# EAGLE design microsd (EAGLE 6.5.0)
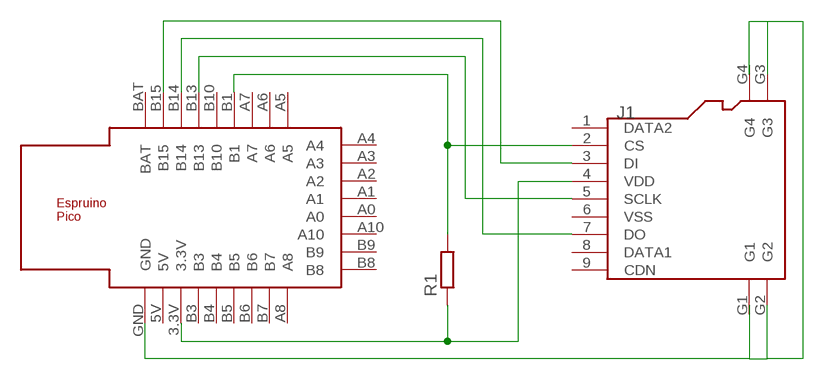
[diagram p0: schematic, sheet 1]

## Parts
J1  MICRO-SDCARD-CONNECTOR-3300060P1  [9P-SMD-W/-RING]
R1  R-EU_R1206  [R1206]
U$1  ESPRUINO_PICO_SMDONLY  [ESPRUINO_PICO_SMDONLY]

## Nets
N$2: U$1.GND
N$3: J1.4(VDD) R1.1 U$1.3.3V
N$4: J1.3(DI) U$1.B15
N$5: J1.7(DO) U$1.B14
N$6: J1.5(SCLK) U$1.B13
N$7: J1.2(CS) R1.2 U$1.B1
Unconnected: J1.1(DATA2) J1.6(VSS) J1.8(DATA1) J1.9(CDN) J1.G1 J1.G2 J1.G3 J1.G4 U$1.5V U$1.A0 U$1.A1 U$1.A2 U$1.A3 U$1.A4 U$1.A5 U$1.A6 U$1.A7 U$1.A8 U$1.A10 U$1.B3 U$1.B4 U$1.B5 U$1.B6 U$1.B7 U$1.B8 U$1.B9 U$1.B10 U$1.BAT

## Library data of the parts
J1 = OPL Eagle Library:MICRO-SDCARD-CONNECTOR
R1 = rcl:R-EU_: RESISTOR, European symbol
U$1 = espruino_pico:ESPRUINO_PICO_SMDONLY

## Net classes
0 default: width 0.305 mm

## Board
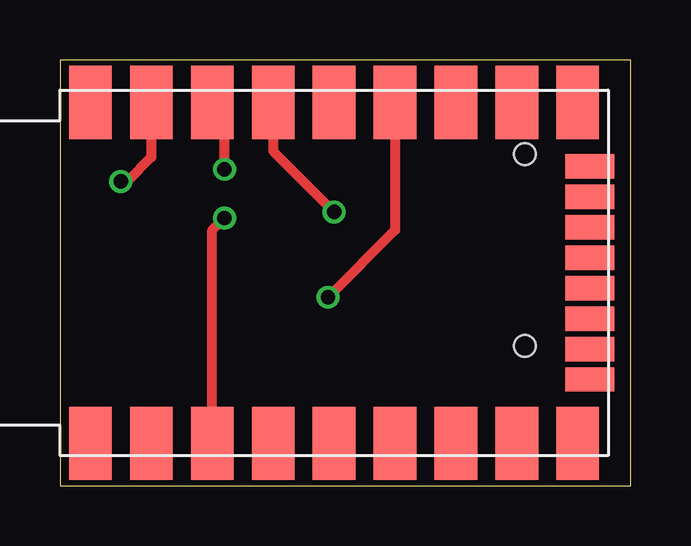
[diagram p1: board, top side]
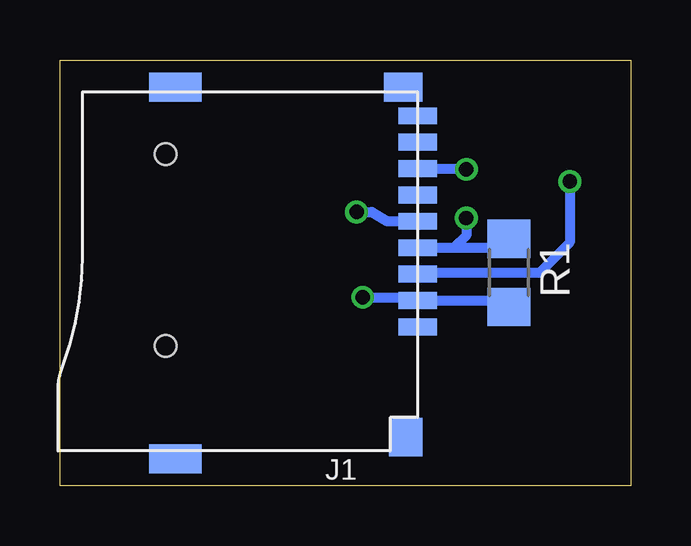
[diagram p2: board, bottom side, seen from below]

Size 23.8 x 17.77 mm. Coordinates in mm from the lower left corner, seen from the top.
Outline: 0,0 23.8,0 23.8,17.77 0,17.77 0,0
Copper layers (1*16): Top 0.0356mm / dielectric 1.5011mm / Bottom 0.0356mm
Design rules "oshpark": minimum track width 10mil, minimum drill 13mil, track to track 8mil, track to pad 6mil, pad to pad 6mil, via to via 6mil, smd to smd 6mil, copper to edge 15mil, drill to drill 6mil, minimum pad ring 7mil, minimum via ring 7mil, stop-mask expansion 4mil, vias tented up to drill 15mil, thermal gap 10mil

### Footprints (pad centres in the part's own frame; a part is rotated, then mirrored left to right if it is on the bottom)
9P-SMD-W/-RING = smd 1.6 x 0.7: 1 0,2.25; 2 0,1.15; 3 0,0.05; 4 0,-1.05; 5 0,-2.15; 6 0,-3.25; 7 0,-4.35; 8 0,-5.45; 9 0,-6.55 | smd 1.6 x 1.2: G1 0.6,-7.75 | smd 2.2 x 1.2: G2 10.1,-7.75; G3 10.1,7.75 | smd 1.4 x 1.6: G4 0.5,6.85 | hole 0.9: 10.5,-4.95; 10.5,3.05
R1206 = smd 1.6 x 1.803: 1 -1.422,0; 2 1.422,0
ESPRUINO_PICO_SMDONLY = smd 1.778 x 3.048: 3.3V -8.89,-7.112; 5V -11.43,-7.112; A5 6.35,7.112; A6 3.81,7.112; A7 1.27,7.112; A8 6.35,-7.112; B1 -1.27,7.112; B3 -6.35,-7.112; B4 -3.81,-7.112; B5 -1.27,-7.112; B6 1.27,-7.112; B7 3.81,-7.112; B10 -3.81,7.112; B13 -6.35,7.112; B14 -8.89,7.112; B15 -11.43,7.112; BAT -13.97,7.112; GND -13.97,-7.112 | smd 2.032 x 1.016: A0 6.858,-0.635; A1 6.858,0.635; A2 6.858,1.905; A3 6.858,3.175; A4 6.858,4.445; A10 6.858,-1.905; B8 6.858,-4.445; B9 6.858,-3.175

### Placement (x,y rotation side)
J1  8.89,8.89 180 bottom
R1  5.08,8.89 270 bottom
U$1  15.24,8.89 0 top

### Tracks (layer width: path | path; a pad name or v marks a point on that pad's centre or on a via)
N$3  (via drill 0.6)
  Top 0.406: U$1.3.3V 6.35,10.67 v6.86,11.18
  Bottom 0.406: J1.4 7.37,9.94 | 7.37,9.94 5.45,9.94 R1.1 | v6.86,11.18 6.86,10.45 7.37,9.94
N$4  (via drill 0.6)
  Top 0.406: U$1.B15 3.81,13.72 2.79,12.7 v2.54,12.7
  Bottom 0.406: v2.54,12.7 2.54,10.16 3.81,8.89 8.84,8.89 J1.3
N$5  (via drill 0.6)
  Top 0.406: v6.86,13.21 6.86,15.49 U$1.B14
  Bottom 0.406: J1.7 6.89,13.24 v6.86,13.21
N$6  (via drill 0.6)
  Top 0.406: U$1.B13 8.89,13.97 v11.43,11.43
  Bottom 0.406: v11.43,11.43 10.79,11.43 10.16,11.05 9.13,11.05 J1.5
N$7  (via drill 0.6)
  Top 0.406: U$1.B1 13.97,10.67 v11.18,7.87
  Bottom 0.406: v11.18,7.87 9.02,7.87 J1.2 5.35,7.74 R1.2